# Altium schematic sheet CurrentManager-top.SchDoc: Current Controller
size A4
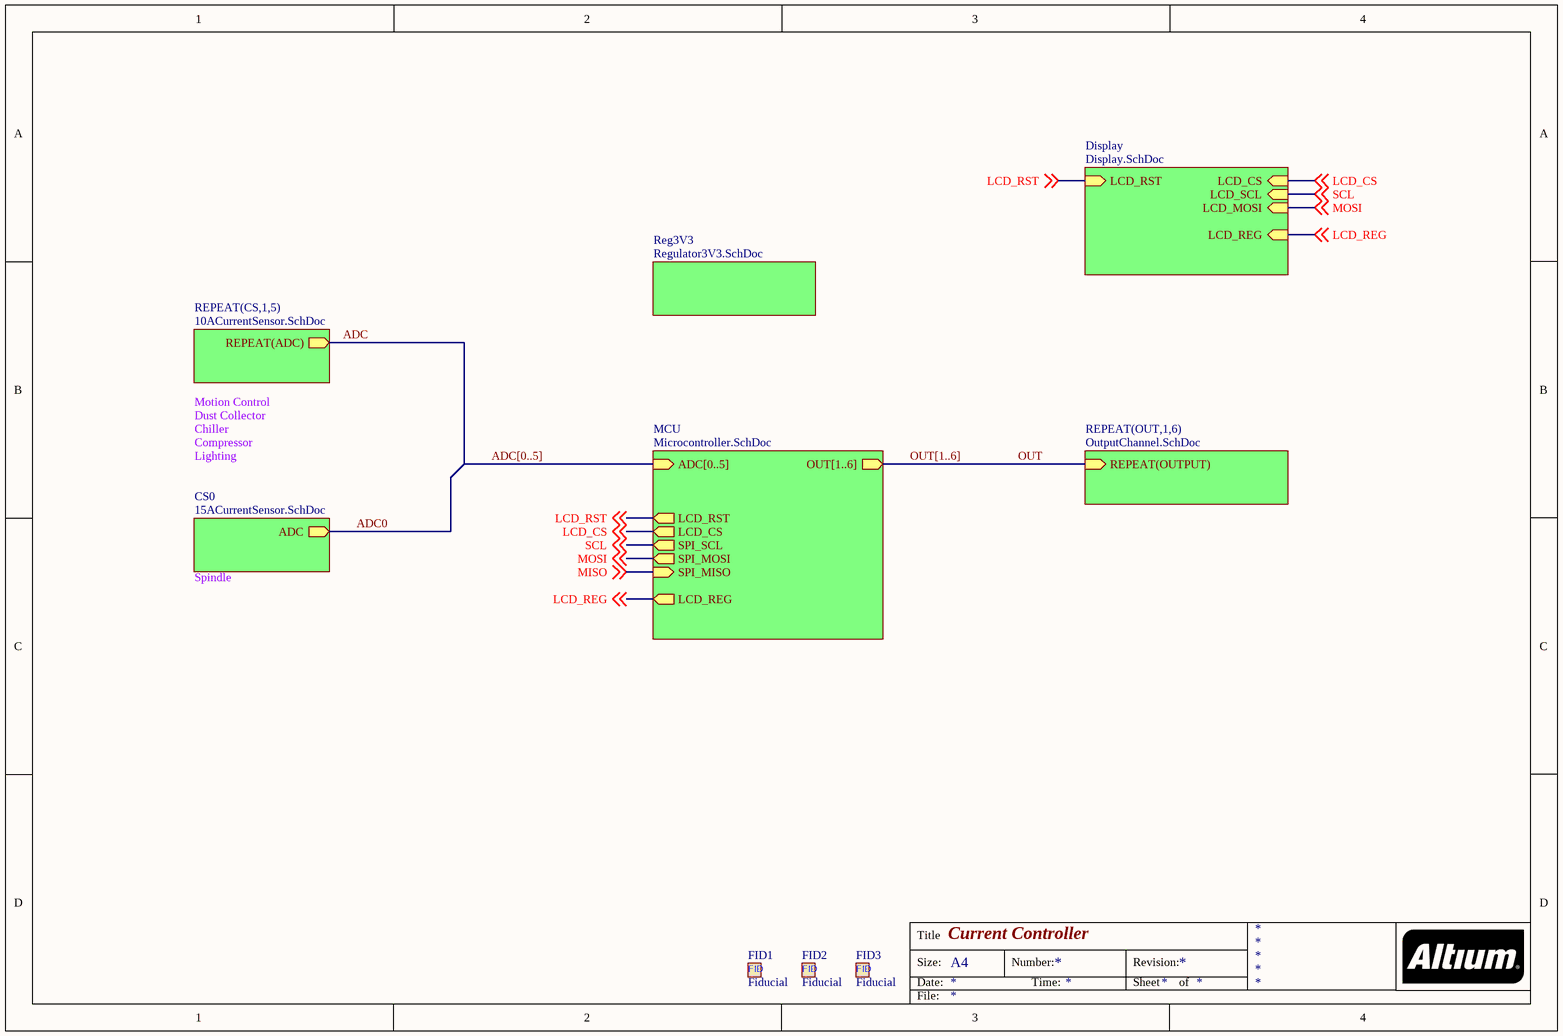
[diagram p0: CurrentManager-top.SchDoc]

## Parts
FID1  Fiducial  [Fiducial]  (no BOM)
FID2  Fiducial  [Fiducial]  (no BOM)
FID3  Fiducial  [Fiducial]  (no BOM)

## Sub-sheets
CS0 = 15ACurrentSensor.SchDoc: ADC (out)
Display = Display.SchDoc: LCD_RST (in), LCD_CS (in), LCD_SCL (in), LCD_MOSI (in), LCD_REG (in)
MCU = Microcontroller.SchDoc: ADC[0..5] (in), LCD_RST (out), LCD_CS (out), SPI_SCL (out), SPI_MOSI (out), LCD_REG (out), SPI_MISO (in), OUT[1..6] (out)
Reg3V3 = Regulator3V3.SchDoc: no entries
REPEAT(CS,1,5) = 10ACurrentSensor.SchDoc: REPEAT(ADC) (out)
REPEAT(OUT,1,6) = OutputChannel.SchDoc: REPEAT(OUTPUT) (in)

## Nets
ADC: sheet REPEAT(CS,1,5)/REPEAT(ADC)
ADC0: sheet CS0/ADC
LCD_CS: off-sheet LCD_CS, sheet MCU/LCD_CS, sheet Display/LCD_CS
LCD_REG: off-sheet LCD_REG, sheet MCU/LCD_REG, sheet Display/LCD_REG
LCD_RST: off-sheet LCD_RST, sheet MCU/LCD_RST, sheet Display/LCD_RST
MISO: off-sheet MISO, sheet MCU/SPI_MISO
MOSI: off-sheet MOSI, sheet MCU/SPI_MOSI, sheet Display/LCD_MOSI
OUT: sheet REPEAT(OUT,1,6)/REPEAT(OUTPUT)
SCL: off-sheet SCL, sheet MCU/SPI_SCL, sheet Display/LCD_SCL

## Buses and harness runs
bus ADC[0..5] = sheet MCU/ADC[0..5]
bus OUT[1..6] = sheet MCU/OUT[1..6]

## Notes on the sheet
- Motion Control
- Dust Collector
- Compressor
- Chiller
- Lighting
- Spindle
- Title
- Size:
- Date:
- A4
- Number:
- Time:
- Revision:
- Sheet
- of
- File:
- (in symbol Fiducial) FID